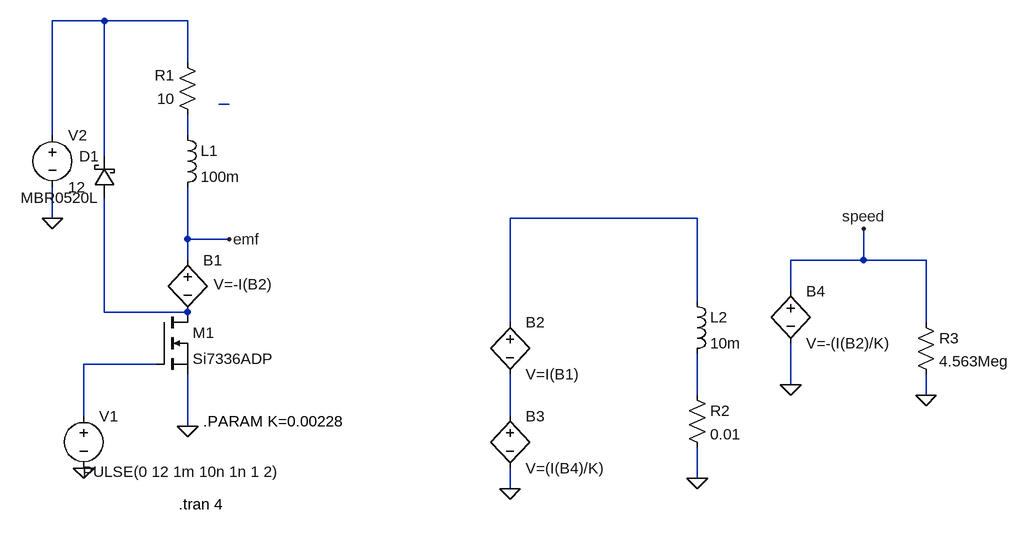
[diagram p0: schematic MotorModel.asc]
MotorModel.asc, the LTspice schematic file:
Version 4
SHEET 1 1316 680
WIRE -352 -272 -432 -272
WIRE -224 -272 -352 -272
WIRE -224 -208 -224 -272
WIRE -160 -144 -176 -144
WIRE -432 -96 -432 -272
WIRE -224 -96 -224 -128
WIRE -352 -64 -352 -272
WIRE -432 32 -432 -16
WIRE 560 32 272 32
WIRE -224 64 -224 -16
WIRE -160 64 -224 64
WIRE -224 96 -224 64
WIRE 816 96 816 48
WIRE 816 96 704 96
WIRE 912 96 816 96
WIRE 704 144 704 96
WIRE 560 160 560 32
WIRE -352 176 -352 0
WIRE -224 176 -352 176
WIRE 272 192 272 32
WIRE 912 192 912 96
WIRE -272 256 -384 256
WIRE 704 288 704 224
WIRE 560 304 560 240
WIRE 912 304 912 272
WIRE -384 336 -384 256
WIRE 272 336 272 272
WIRE -224 352 -224 272
WIRE 560 432 560 384
WIRE 272 448 272 416
FLAG -384 416 0
FLAG -160 64 emf
FLAG 560 432 0
FLAG 272 448 0
FLAG 912 304 0
FLAG 704 288 0
FLAG 816 48 speed
FLAG -224 352 0
FLAG -432 32 0
SYMBOL voltage -384 320 R0
WINDOW 3 302 102 Right 2
WINDOW 123 0 0 Left 0
WINDOW 39 0 0 Left 0
SYMATTR InstName V1
SYMATTR Value PULSE(0 12 1m 10n 1n 1 2)
SYMBOL ind -240 -112 R0
SYMATTR InstName L1
SYMATTR Value 100m
SYMBOL res -208 -112 R180
WINDOW 0 36 76 Left 2
WINDOW 3 36 40 Left 2
SYMATTR InstName R1
SYMATTR Value 10
SYMBOL bv -224 80 R0
WINDOW 3 40 53 Left 2
SYMATTR InstName B1
SYMATTR Value V=-I(B2)
SYMBOL bv 272 176 R0
SYMATTR InstName B2
SYMATTR Value V=I(B1)
SYMBOL ind 544 144 R0
SYMATTR InstName L2
SYMATTR Value 10m
SYMBOL res 544 288 R0
SYMATTR InstName R2
SYMATTR Value 0.01
SYMBOL bv 272 320 R0
SYMATTR InstName B3
SYMATTR Value V=(I(B4)/K)
SYMBOL bv 704 128 R0
SYMATTR InstName B4
SYMATTR Value V=-(I(B2)/K)
SYMBOL res 896 176 R0
SYMATTR InstName R3
SYMATTR Value 4.563Meg
SYMBOL nmos -272 176 R0
SYMATTR InstName M1
SYMATTR Value Si7336ADP
SYMBOL voltage -432 -112 R0
SYMATTR InstName V2
SYMATTR Value 12
SYMBOL schottky -336 0 R180
WINDOW 0 24 64 Left 2
WINDOW 3 24 0 Left 2
SYMATTR InstName D1
SYMATTR Value MBR0520L
SYMATTR Description Diode
SYMATTR Type diode
TEXT -200 344 Left 2 !.PARAM K=0.00228
TEXT -238 472 Left 2 !.tran 4

The netlist it stands for:
* MotorModel.asc
V1 N006 0 PULSE(0 12 1m 10n 1n 1 2)
L1 N003 emf 100m
R1 N003 N001 10
B1 emf N005 V=-I(B2)
B2 N004 N008 V=I(B1)
L2 N004 N007 10m
R2 N007 0 0.01
B3 N008 0 V=(I(B4)/K)
B4 speed 0 V=-(I(B2)/K)
R3 speed 0 4.563Meg
M1 N005 N006 0 0 Si7336ADP
V2 N001 0 12
D1 N005 N001 MBR0520L
.model D D
.lib standard.dio
.model NMOS NMOS
.model PMOS PMOS
.lib standard.mos
.PARAM K=0.00228
.tran 4
.backanno
.end